# EAGLE design Power Switching Circuit (EAGLE 9.6.2)
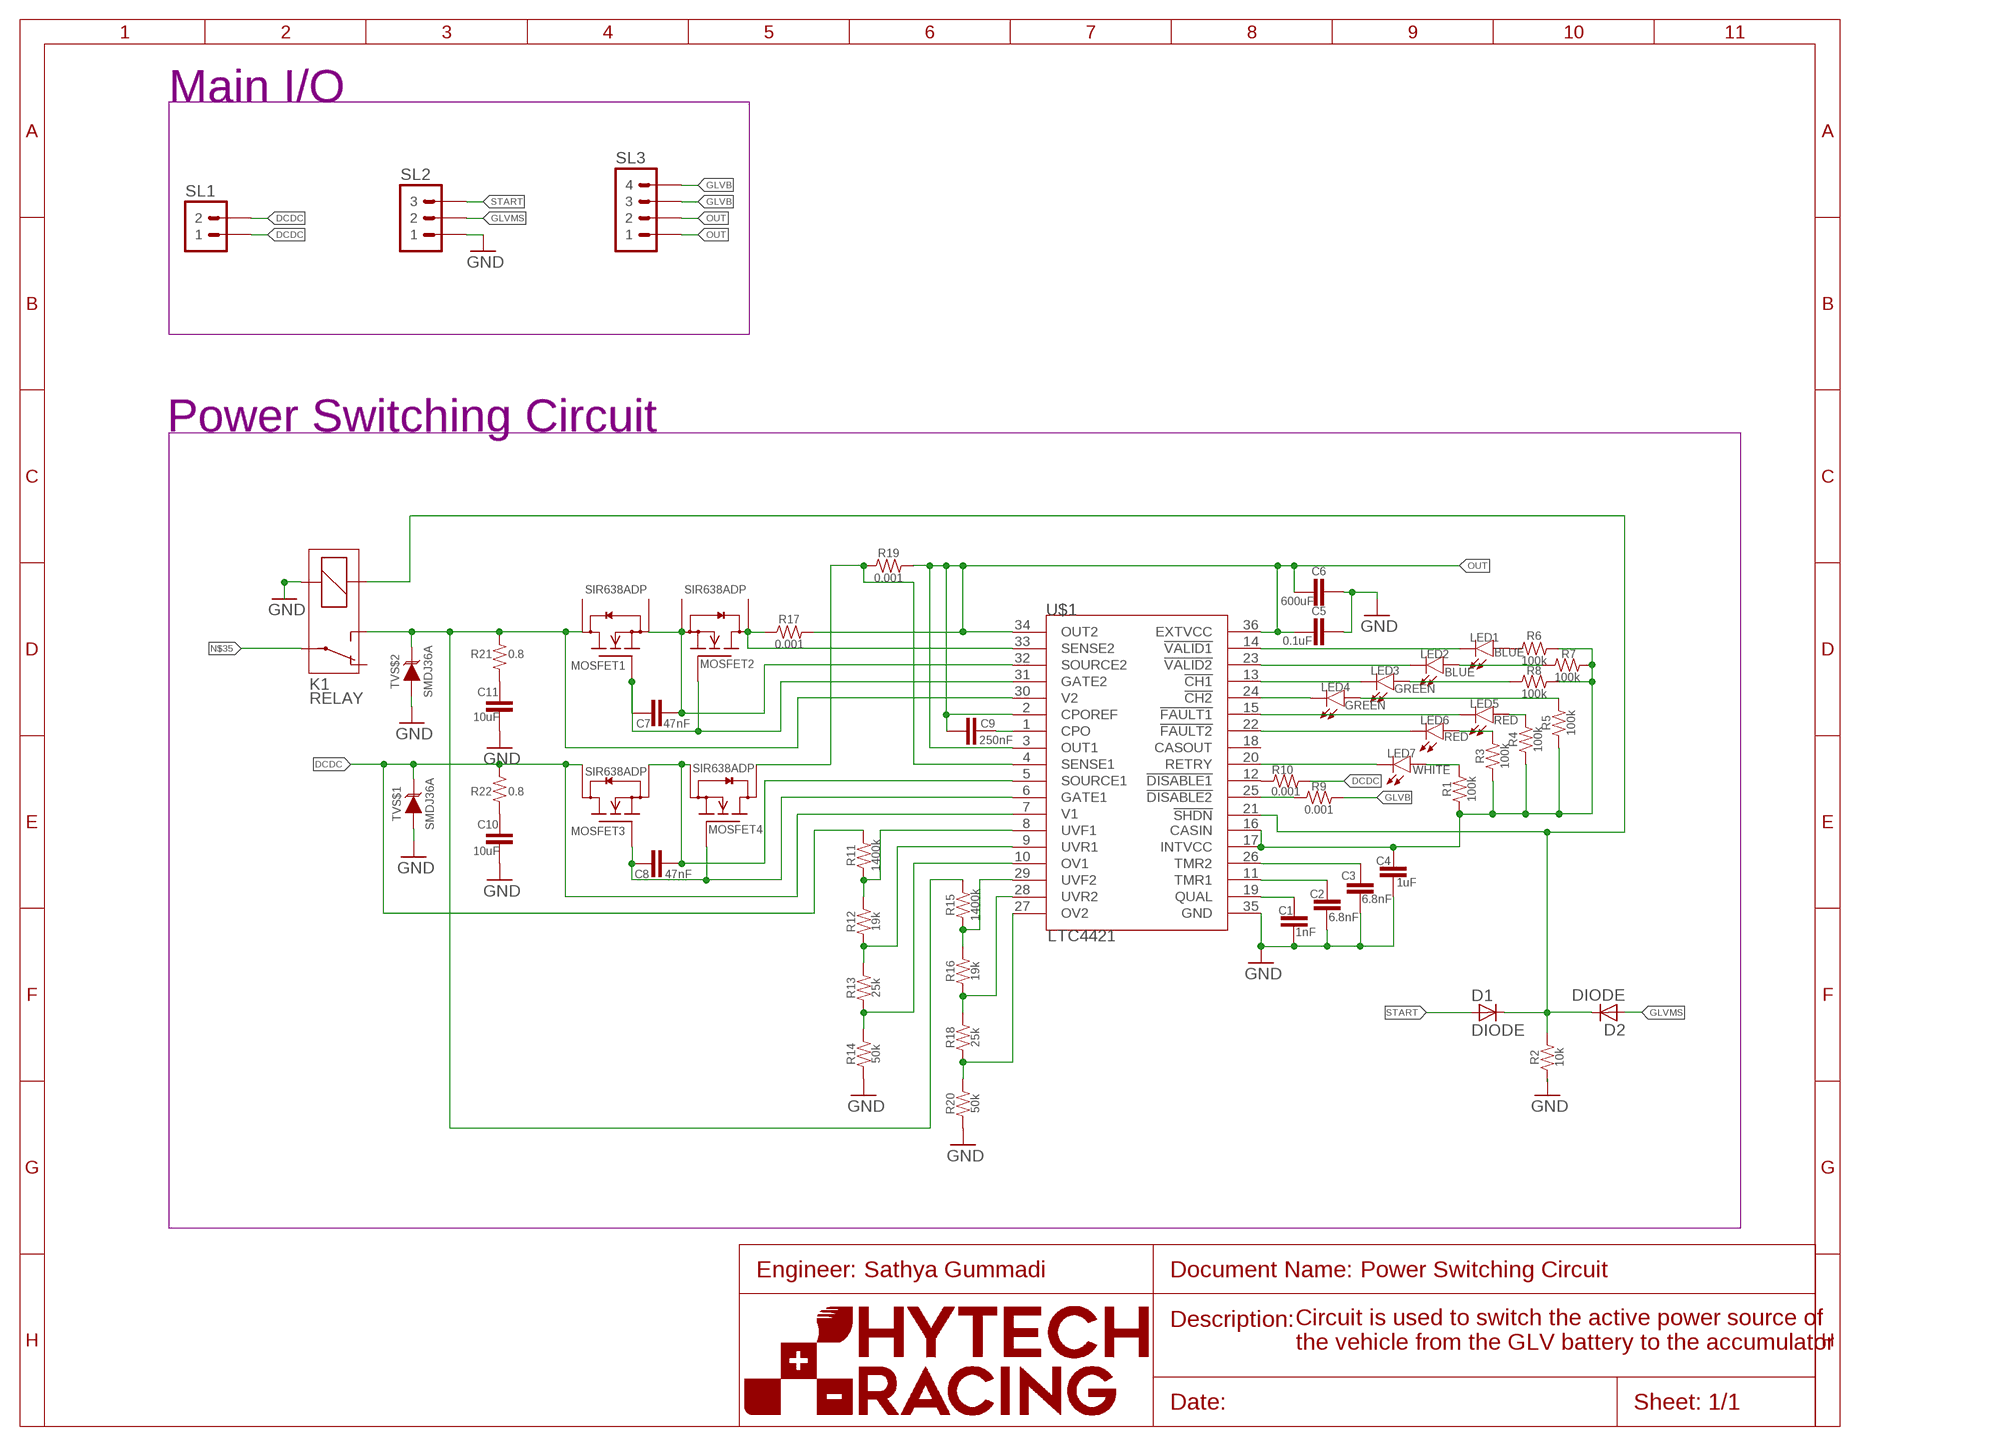
[diagram p0: schematic, sheet 1]
U$2 (FRAME_A): FRAME_DESCRIPTION: Default; ORIENTATION: LANDSCAPE; SIZE: A

## Parts
C1  1nF  CAP0603-CAP  [0603-CAP]
C2  6.8nF  CAP0603-CAP  [0603-CAP]
C3  6.8nF  CAP0603-CAP  [0603-CAP]
C4  1uF  CAP0603-CAP  [0603-CAP]
C5  0.1uF  CAP0603-CAP  [0603-CAP]
C6  600uF  CAP0603-CAP  [0603-CAP]
C7  47nF  CAP0603-CAP  [0603-CAP]
C8  47nF  CAP0603-CAP  [0603-CAP]
C9  250nF  CAP0603-CAP  [0603-CAP]
C10  10uF  CAP0603-CAP  [0603-CAP]
C11  10uF  CAP0603-CAP  [0603-CAP]
D1  DIODE  (no package)
D2  DIODE  (no package)
K1  RELAY  (no package)
LED1  BLUE  LED-0603  [LED-603]
LED2  BLUE  LED-0603  [LED-603]
LED3  GREEN  LED-0603  [LED-603]
LED4  GREEN  LED-0603  [LED-603]
LED5  RED  LED-0603  [LED-603]
LED6  RED  LED-0603  [LED-603]
LED7  WHITE  LED-0603  [LED-603]
MOSFET1  SIR638ADP  [SO-8-POWERPAK]
MOSFET2  SIR638ADP  [SO-8-POWERPAK]
MOSFET3  SIR638ADP  [SO-8-POWERPAK]
MOSFET4  SIR638ADP  [SO-8-POWERPAK]
R1  100k  RESISTOR0603  [0603-RES]
R2  10k  RESISTOR0603  [0603-RES]
R3  100k  RESISTOR0603  [0603-RES]
R4  100k  RESISTOR0603  [0603-RES]
R5  100k  RESISTOR0603  [0603-RES]
R6  100k  RESISTOR0603  [0603-RES]
R7  100k  RESISTOR0603  [0603-RES]
R8  100k  RESISTOR0603  [0603-RES]
R9  0.001  RESISTOR0603  [0603-RES]
R10  0.001  RESISTOR0603  [0603-RES]
R11  1400k  RESISTOR0603  [0603-RES]
R12  19k  RESISTOR0603  [0603-RES]
R13  25k  RESISTOR0603  [0603-RES]
R14  50k  RESISTOR0603  [0603-RES]
R15  1400k  RESISTOR0603  [0603-RES]
R16  19k  RESISTOR0603  [0603-RES]
R17  0.001  RESISTOR0603  [0603-RES]
R18  25k  RESISTOR0603  [0603-RES]
R19  0.001  RESISTOR0603  [0603-RES]
R20  50k  RESISTOR0603  [0603-RES]
R21  0.8  RESISTOR0603  [0603-RES]
R22  0.8  RESISTOR0603  [0603-RES]
SL1  M02  (no package)
SL2  M03  (no package)
SL3  M04  (no package)
TVS$1  SMDJ36A  [SMDJ36A]
TVS$2  SMDJ36A  [SMDJ36A]
U$1  LTC4421  [TSSOP-36]

## Nets
DCDC: MOSFET3.8(D) R10.2 R11.2 R22.2 SL1.1 SL1.2 TVS$1.P$2(C) U$1.7(V1)
GLVB: K1.S MOSFET1.6(D) R9.2 R15.2 R21.2 SL3.3 SL3.4 TVS$2.P$2(C) U$1.30(V2)
GLVMS: D2.A SL2.2
GND: C1.2 C2.2 C3.2 C4.2 C5.1 C6.1 C10.2 C11.2 K1.2 R2.1 R14.1 R20.1 SL2.1 TVS$1.P$1(A) TVS$2.P$1(A) U$1.35(GND)
N$1: R10.1 U$1.12(!DISABLE1)
N$2: C3.1 U$1.26(TMR2)
N$3: C2.1 U$1.11(TMR1)
N$4: C1.1 U$1.19(QUAL)
N$5: LED7.C U$1.20(RETRY)
N$6: LED1.A R6.1
N$7: LED4.C U$1.24(!CH2)
N$8: C7.1 MOSFET1.2(S) MOSFET2.2(S) U$1.32(SOURCE2)
N$9: LED6.C U$1.22(!FAULT2)
N$10: LED5.C U$1.15(!FAULT1)
N$11: LED3.C U$1.13(!CH1)
N$12: LED2.C U$1.23(!VALID2)
N$13: LED1.C U$1.14(!VALID1)
N$14: LED4.A R5.2
N$15: LED3.A R8.1
N$16: LED2.A R7.1
N$17: LED7.A R1.2
N$18: D1.C D2.C K1.1 R2.2 U$1.21(!SHDN)
N$19: LED6.A R3.2
N$20: LED5.A R4.2
N$21: C4.1 R1.1 R3.1 R4.1 R5.1 R6.2 R7.2 R8.2 U$1.16(CASIN) U$1.17(INTVCC)
N$22: R9.1 U$1.25(!DISABLE2)
N$23: R18.1 R20.2 U$1.27(OV2)
N$24: R16.1 R18.2 U$1.28(UVR2)
N$25: R15.1 R16.2 U$1.29(UVF2)
N$26: R11.1 R12.2 U$1.8(UVF1)
N$27: C8.1 MOSFET3.4(S) MOSFET4.4(S) U$1.5(SOURCE1)
N$28: R12.1 R13.2 U$1.9(UVR1)
N$29: R13.1 R14.2 U$1.10(OV1)
N$30: C11.1 R21.1
N$31: MOSFET2.6(D) R17.1 U$1.33(SENSE2)
N$32: C7.2 MOSFET1.1(G) MOSFET2.1(G) U$1.31(GATE2)
N$33: C10.1 R22.1
N$34: C8.2 MOSFET3.1(G) MOSFET4.1(G) U$1.6(GATE1)
N$35: K1.P
N$38: C9.1 U$1.1(CPO)
N$40: MOSFET4.8(D) R19.1 U$1.4(SENSE1)
OUT: C5.2 C6.2 C9.2 R17.2 R19.2 SL3.1 SL3.2 U$1.2(CPOREF) U$1.3(OUT1) U$1.34(OUT2) U$1.36(EXTVCC)
START: D1.A SL2.3
Unconnected: K1.O MOSFET1.3(S) MOSFET1.4(S) MOSFET1.5(D) MOSFET1.7(D) MOSFET1.8(D) MOSFET2.3(S) MOSFET2.4(S) MOSFET2.5(D) MOSFET2.7(D) MOSFET2.8(D) MOSFET3.2(S) MOSFET3.3(S) MOSFET3.5(D) MOSFET3.6(D) MOSFET3.7(D) MOSFET4.2(S) MOSFET4.3(S) MOSFET4.5(D) MOSFET4.6(D) MOSFET4.7(D) U$1.18(CASOUT)

## Notes on the sheet
- Main I/O
- Power Switching Circuit
- Sathya Gummadi
- Circuit is used to switch the active power source of 
  the vehicle from the GLV battery to the accumulator

## Library data of the parts
C1-C11 = HyTechDevices:CAP: Capacitor Standard 0603 ceramic capacitor, and 0.1" leaded capacitor.
D1 D2 = HyTechSymbols:DIODE: Generic Diode
K1 = HyTechSymbols:RELAY: RELAY 1 x switch
LED1-LED7 = HyTechDevices:LED: Light Emitting Diode (LED) Source: Dangerous Prototypes Eagle Library <https://github.com/DangerousPrototypes/Eagle_Part_Library>
MOSFET1-MOSFET4 = HyTechDevices:SIR638ADP: Vishay Siliconix SiR638ADP N-Channel 40 V (D-S) MOSFET Datasheet <https://www.vishay.com/docs/75297/sir638adp.pdf>
R1-R22 = HyTechDevices:RESISTOR: Resistor Basic schematic elements and footprints for 0603, 1206, and PTH resistors.
SL1 = HyTechSymbols:M02: Generic 2-pin connector
SL2 = HyTechSymbols:M03: Generic 3-pin connector
SL3 = HyTechSymbols:M04: Generic 4-pin connector
TVS$1 TVS$2 = HyTechDevices:SMDJ36A: Littlefuse SMDJ36A TVS Diode Datasheet <https://www.littelfuse.com/~/media/electronics/datasheets/tvs_diodes/littelfuse_tvs_diode_smdj_datasheet.pdf.pdf>
U$1 = HyTechDevices:LTC4421: LTC4421 High Power Prioritized PowerPath Controller Datasheet <https://www.analog.com/media/en/technical-documentation/data-sheets/LTC4421.pdf>

## Board
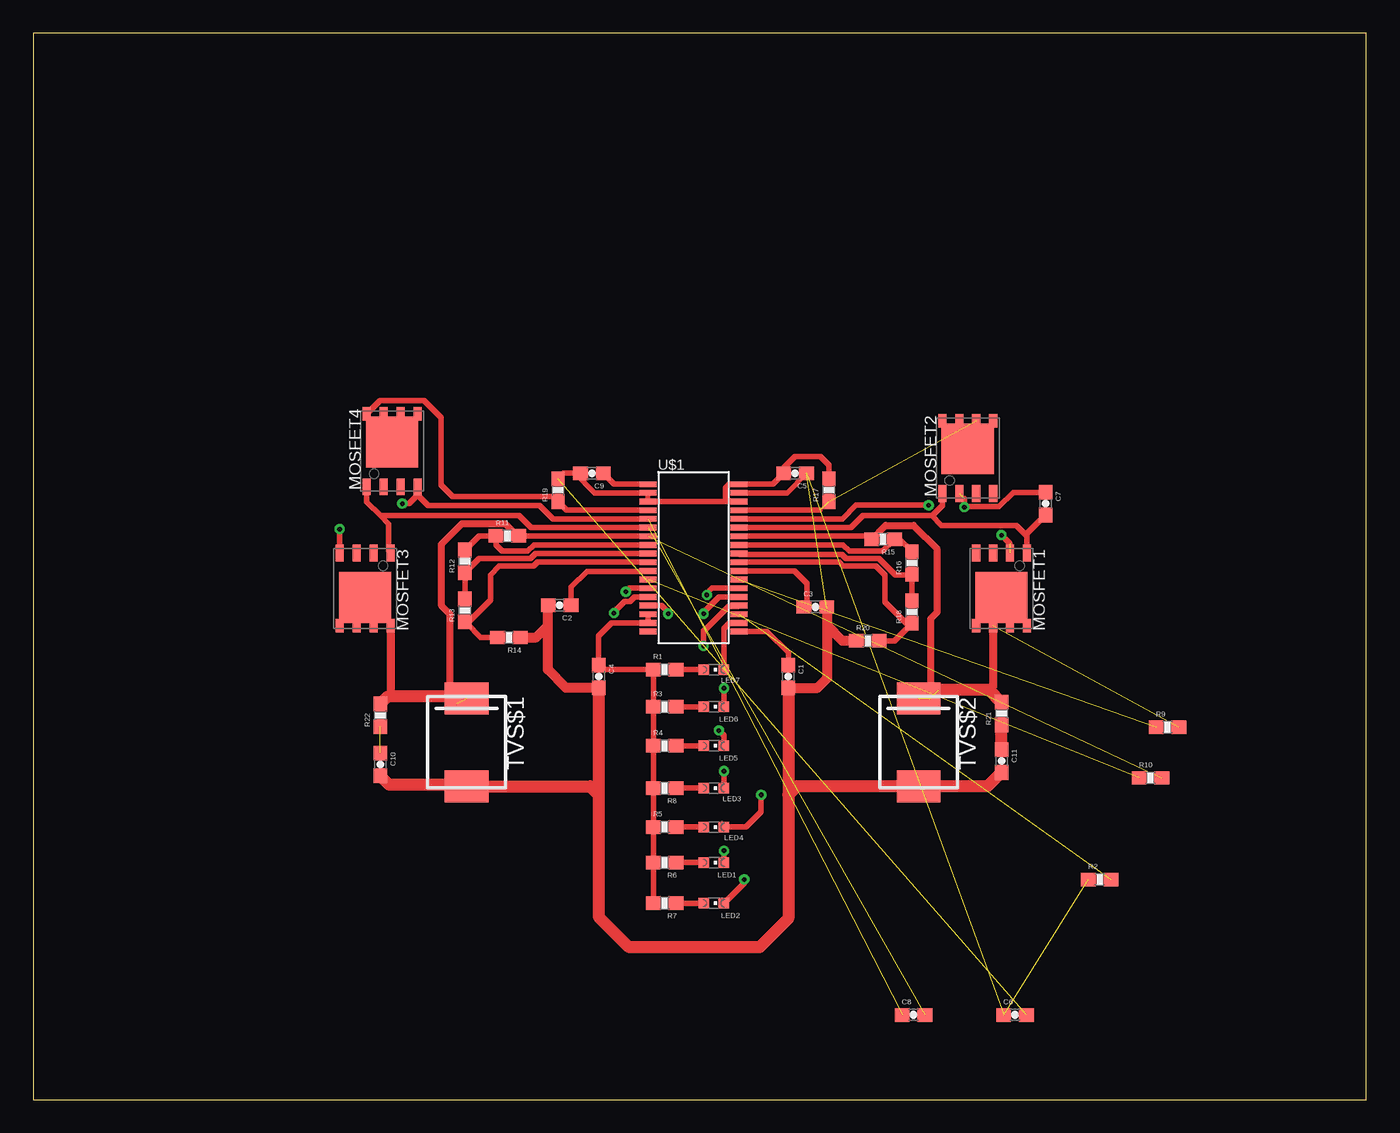
[diagram p1: board, top side]
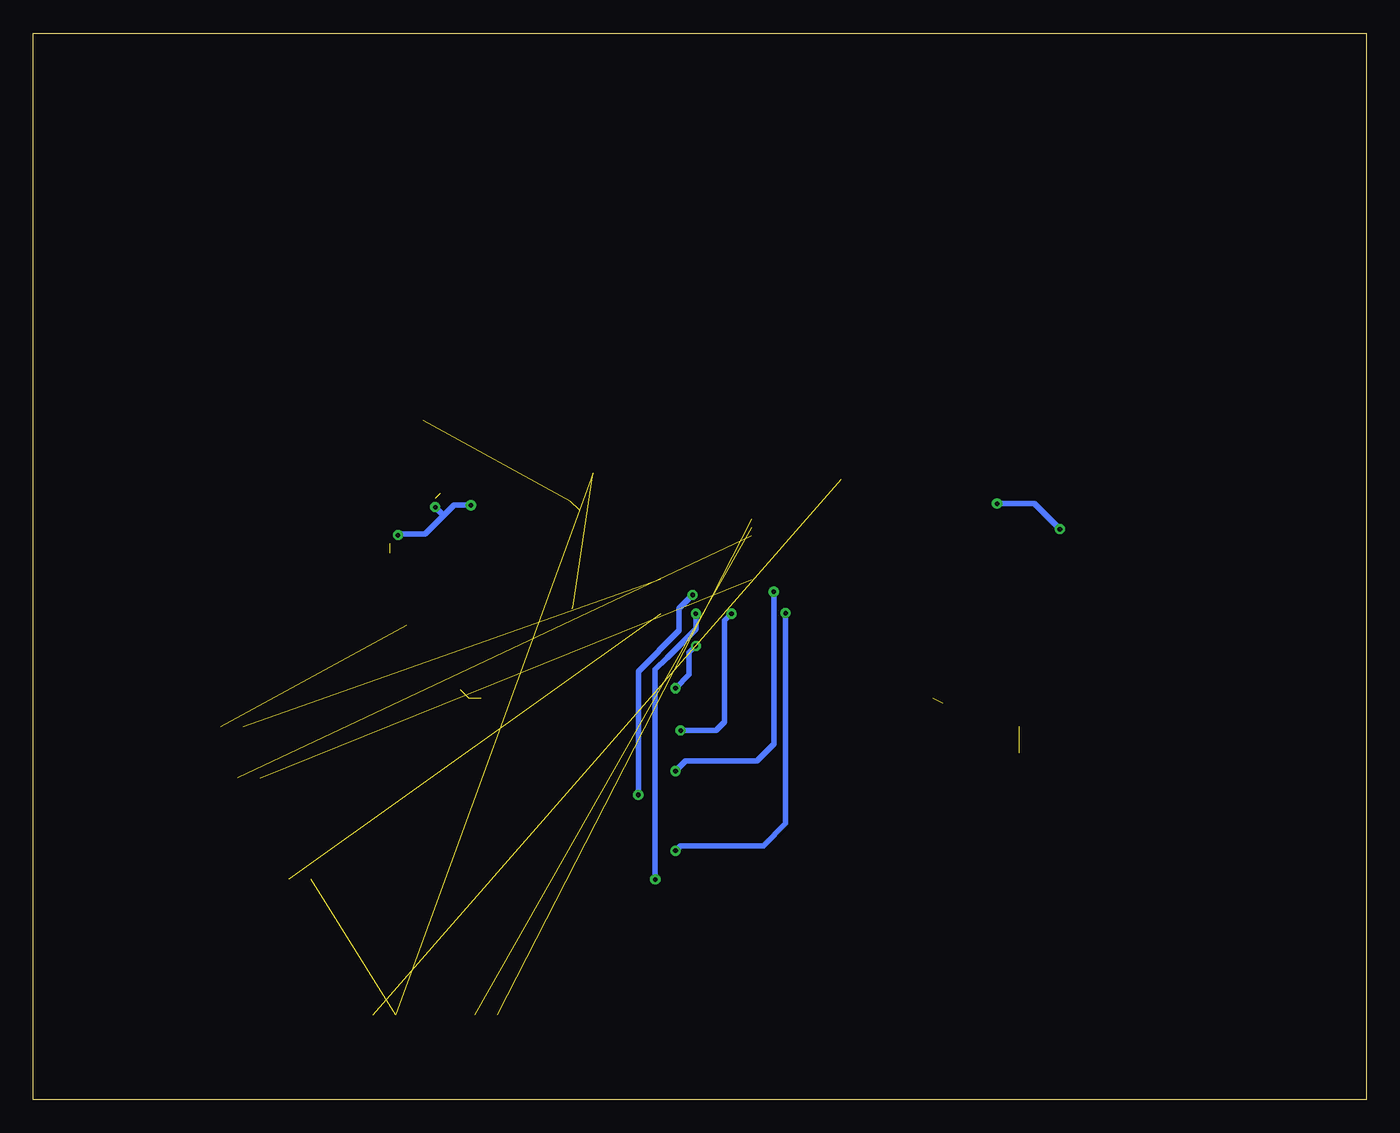
[diagram p2: board, bottom side, seen from below]

Size 100 x 80 mm. Coordinates in mm from the lower left corner, seen from the top.
Outline: 0,0 100,0 100,80 0,80 0,0
Copper layers (1*16): Top 0.035mm / dielectric 1.5mm / Bottom 0.035mm
Design rules "default": minimum track width 6mil, minimum drill 0.35mm, track to track 6mil, track to pad 6mil, pad to pad 6mil, via to via 6mil, smd to smd 6mil, copper to edge 40mil, drill to drill 6mil, minimum pad ring 10mil, minimum via ring 8mil, stop-mask expansion 4mil, vias tented up to drill 0mil, thermal gap 10mil

### Footprints (pad centres in the part's own frame; a part is rotated, then mirrored left to right if it is on the bottom)
0603-CAP = smd 1.1 x 1: 1 -0.85,0; 2 0.85,0
LED-603 = smd 0.8 x 0.8: A 0,-0.75; C 0,0.75
SO-8-POWERPAK = smd 1.27 x 0.61: 1 -3.429,1.905; 2 -3.429,0.635; 3 -3.429,-0.635; 4 -3.429,-1.905 | smd 1.016 x 0.61: 5 2.032,-1.905; 6 2.032,-0.635; 7 2.032,0.635; 8 2.032,1.905 | smd 3.81 x 3.912: P$1 -0.076,0
0603-RES = smd 1.1 x 1: 1 -0.85,0; 2 0.85,0
SMDJ36A = smd 2.388 x 3.277: P$1 3.302,0; P$2 -3.302,0
TSSOP-36 = smd 1.27 x 0.432: 1 -3.404,5.527; 2 -3.404,4.877; 3 -3.404,4.227; 4 -3.404,3.576; 5 -3.404,2.926; 6 -3.404,2.276; 7 -3.404,1.626; 8 -3.404,0.975; 9 -3.404,0.325; 10 -3.404,-0.325; 11 -3.404,-0.975; 12 -3.404,-1.626; 13 -3.404,-2.276; 14 -3.404,-2.926; 15 -3.404,-3.576; 16 -3.404,-4.227; 17 -3.404,-4.877; 18 -3.404,-5.527; 19 3.404,-5.527; 20 3.404,-4.877; 21 3.404,-4.227; 22 3.404,-3.576; 23 3.404,-2.926; 24 3.404,-2.276; 25 3.404,-1.626; 26 3.404,-0.975; 27 3.404,-0.325; 28 3.404,0.325; 29 3.404,0.975; 30 3.404,1.626; 31 3.404,2.276; 32 3.404,2.926; 33 3.404,3.576; 34 3.404,4.227; 35 3.404,4.877; 36 3.404,5.527

### Placement (x,y rotation side)
C1  56.64,31.75 270 top
C2  39.5,37.08 180 top
C3  58.67,36.96 0 top
C4  42.42,31.75 270 top
C5  57.15,46.99 180 top
C6  73.66,6.35 0 top
C7  75.95,44.7 270 top
C8  66.04,6.35 0 top
C9  41.91,46.99 180 top
C10  26.04,25.15 270 top
C11  72.64,25.4 270 top
LED1  51.05,17.78 270 top
LED2  51.05,14.73 270 top
LED3  51.05,23.37 270 top
LED4  51.05,20.45 270 top
LED5  51.05,26.54 270 top
LED6  51.05,29.46 270 top
LED7  51.05,32.26 270 top
MOSFET1  72.64,37.59 270 top
MOSFET2  70.1,48.9 90 top
MOSFET3  24.89,37.59 270 top
MOSFET4  26.92,49.4 90 top
R1  47.37,32.26 0 top
R2  80.01,16.51 0 top
R3  47.37,29.46 0 top
R4  47.37,26.54 0 top
R5  47.37,20.45 0 top
R6  47.37,17.78 180 top
R7  47.37,14.73 180 top
R8  47.37,23.37 180 top
R9  85.09,27.94 0 top
R10  83.82,24.13 0 top
R11  35.56,42.29 0 top
R12  32.38,40.39 90 top
R13  32.38,36.7 90 top
R14  35.69,34.67 180 top
R15  63.75,42.04 180 top
R16  65.91,40.26 90 top
R17  59.69,45.72 90 top
R18  65.91,36.58 90 top
R19  39.37,45.72 90 top
R20  62.61,34.42 0 top
R21  72.64,28.96 90 top
R22  26.04,28.83 90 top
TVS$1  32.51,26.8 270 top
TVS$2  66.42,26.8 270 top
U$1  49.53,40.64 0 top

### Tracks (layer width: path | path; a pad name or v marks a point on that pad's centre or on a via)
DCDC  (2 unrouted)
  Top 0.406: 36.83,42.27 U$1.7 | 32.27,43.2 32.15,43.2 | 31.62,29.59 31.75,29.72
  Top 0.508: 36.83,42.27 36.8,42.29 R11.2 36.34,42.29 35.43,43.2 32.27,43.2 | 33.02,30.61 TVS$1.P$2 | 32.15,43.2 30.61,41.66 30.61,37.08 31.24,36.45 31.24,30.23
  Top 0.61: 26.58,30.23 26.8,30.44 MOSFET3.8
  Top 0.914: TVS$1.P$2 32.38,30.23 31.24,30.23 26.58,30.23 R22.2
GLVB  (3 unrouted)
  Top 0.406: U$1.30 62.67,42.27 R15.2
  Top 0.508: R15.2 63.95,43.08 66.04,43.08 67.82,41.3 67.82,36.58 67.31,36.07 67.31,30.1 | MOSFET1.6 72.01,35.53
  Top 0.61: MOSFET1.6 72.01,31.03 71.72,30.73
  Top 0.914: R21.2 71.72,30.73 67.94,30.73
GND  (4 unrouted)
  Top 0.381: C5.1 56.53,45.52
  Top 0.406: 56.53,45.52 U$1.35 | 38.61,37.05 C2.2 | 56.68,30.86 C1.2
  Top 0.762: 38.61,35.56 38.61,32.26 39.97,30.9 C4.2 | 38.61,35.56 38.61,37.05 | C1.2 58.84,30.9 59.56,31.62 59.56,35.56 | 59.56,35.56 59.56,36.83 | R14.1 37.72,34.67 38.61,35.56 | R20.1 60.71,34.42 59.56,35.56
  Top 0.914: C4.2 42.42,22.86 | 42.42,22.86 42.42,13.72 44.7,11.43 54.48,11.43 56.64,13.59 56.64,22.86 | C1.2 56.64,22.86 | C11.2 71.59,23.5 TVS$2.P$1 57.28,23.5 56.64,22.86 | C10.2 26.71,23.62 32.38,23.62 TVS$1.P$1 41.78,23.5 42.42,22.86
N$1  (1 unrouted)
N$2
  Top 0.406: 57.78,37 C3.1 58.04,37.17 58.04,38.73 57.11,39.66 U$1.26
N$3
  Top 0.406: U$1.11 46.09,39.62 41.53,39.62 40.35,38.44 C2.1
N$4
  Top 0.406: U$1.19 55.06,35.11 56.64,33.53 C1.1
N$5
  Top 0.406: U$1.20 52.23,35.76 51.8,35.34 LED7.C
N$6
  Top 0.406: R6.1 LED1.A
N$7  (via drill 0.35)
  Top 0.406: U$1.24 50.94,38.36 50.53,37.96 v50.53,37.86 | v54.61,22.86 54.61,21.59 53.47,20.45 LED4.C
  Bottom 0.406: v50.53,37.86 51.56,36.83 51.56,35.18 54.61,32.13 v54.61,22.86
N$8  (via drill 0.35)  (2 unrouted)
  Top 0.406: U$1.32 60.69,43.57 61.72,44.59 v67.17,44.59 | v72.64,42.35 73.28,41.71 | 69.85,45.09 v69.85,44.45 69.88,44.48 72.46,44.48 73.54,45.55 C7.1
  Bottom 0.406: v67.17,44.59 68.44,44.59 69.22,43.81 | v72.64,42.35 72.57,42.42 70.61,42.42 69.22,43.81 | v69.85,44.45 69.22,43.81
N$9  (via drill 0.35)
  Top 0.406: U$1.22 52.85,36.98 52.15,36.98 50.34,35.18 50.29,35.18 v50.29,34.04 | v51.82,30.86 51.82,29.48 LED6.C
  Bottom 0.406: v50.29,34.04 50.8,33.53 50.8,31.88 v51.82,30.86
N$10  (via drill 0.35)
  Top 0.406: U$1.15 47.14,37.06 47.62,36.58 v47.62,36.45 | LED5.C 51.8,27.32 v51.44,27.69
  Bottom 0.406: v47.62,36.45 48.13,35.94 48.13,28.32 48.77,27.69 v51.44,27.69
N$11  (via drill 0.35)
  Top 0.406: U$1.13 44.71,38.36 v44.45,38.1 | v51.82,24.64 51.82,23.38 LED3.C
  Bottom 0.406: v44.45,38.1 44.45,26.67 45.72,25.4 51.05,25.4 v51.82,24.64
N$12  (via drill 0.35)
  Top 0.406: U$1.23 51.44,37.71 51.44,37.72 50.23,36.51 v50.29,36.45 | v53.34,16.51 53.34,16.27 LED2.C
  Bottom 0.406: v50.29,36.45 50.29,35.31 52.32,33.27 52.45,33.15 53.34,32.26 v53.34,16.51
N$13  (via drill 0.35)
  Top 0.406: U$1.14 45.1,37.71 44.75,37.37 44.35,37.37 43.56,36.58 v43.56,36.5 | v51.82,18.67 51.82,17.79 LED1.C
  Bottom 0.406: v43.56,36.5 43.56,20.7 45.21,19.05 51.44,19.05 v51.82,18.67
N$14
  Top 0.406: R5.2 LED4.A
N$15
  Top 0.406: R8.1 LED3.A
N$16
  Top 0.406: R7.1 LED2.A
N$17
  Top 0.406: LED7.A R1.2
N$18  (1 unrouted)
N$19
  Top 0.406: R3.2 LED6.A
N$20
  Top 0.406: R4.2 LED5.A
N$21
  Top 0.406: U$1.16 U$1.17 43.38,35.76 42.42,34.8 C4.1 42.76,32.26 R1.1 R3.1 R4.1 R8.2 R5.1 R6.2 R7.2
N$22  (1 unrouted)
N$23
  Top 0.406: U$1.27 60.47,40.31 60.75,40.03 63.22,40.03 63.88,39.37 63.88,37.34 65.49,35.73 R18.1 64.6,34.42 R20.2
N$24
  Top 0.406: R16.1 65.91,39.37 | 65.91,39.37 R18.2 | U$1.28 53.01,40.89 60.69,40.89 60.98,40.59 63.45,40.59 64.67,39.37 65.79,39.37 65.91,39.37
N$25
  Top 0.406: U$1.29 60.75,41.62 61.21,41.15 63.72,41.15 R15.1 65.02,42.04 65.91,41.15 R16.2
N$26
  Top 0.406: R12.2 33.44,42.29 R11.1 34.71,41.62 35.18,41.15 37.08,41.15 37.55,41.62 U$1.8
N$27  (via drill 0.35)  (1 unrouted)
  Top 0.406: U$1.5 38.98,43.57 37.98,44.56 29.6,44.56 28.83,45.34 | v27.69,44.7 28.19,44.7 28.83,45.34 | MOSFET3.4 v22.99,42.8 | MOSFET4.4 28.83,45.34
  Bottom 0.406: v22.99,42.8 24.89,44.7 v27.69,44.7
N$28
  Top 0.406: R13.2 R12.1 33.44,40.59 37.31,40.59 37.69,40.97 U$1.9
N$29
  Top 0.406: R13.1 32.53,35.71 | 32.53,35.71 33.57,34.67 R14.2 | U$1.10 37.83,40.31 37.55,40.03 34.95,40.03 34.29,39.37 34.29,37.47 32.53,35.71
N$30
  Top 0.914: C11.1 R21.1
N$31  (2 unrouted)
  Top 0.406: U$1.33 59.04,44.22
N$32
  Top 0.406: U$1.31 60.31,42.92 | 60.33,42.93 60.31,42.92 | 74.55,42.29 73.76,43.08 68.15,43.08 67.42,43.81 | C7.2 74.55,42.46 74.55,42.29 | 67.42,43.81 62.23,43.81 61.33,42.92 60.31,42.92 | 67.42,43.81 67.45,43.85 67.48,43.85 68.2,44.58 MOSFET2.1 | MOSFET1.1 74.55,42.29
N$33  (1 unrouted)
N$34  (1 unrouted)
  Top 0.406: U$1.6 37.34,42.92 36.45,43.81 26.04,43.81 | 26.04,43.81 25.02,44.83 MOSFET4.1 | MOSFET3.1 26.67,41.15 26.67,43.18 26.04,43.81
N$38
  Top 0.406: U$1.1 43.58,46.17 C9.1
N$40
  Top 0.406: U$1.4 40.02,44.22 R19.1 38.99,45.25 31.46,45.25 30.61,46.1 30.61,51.18 29.34,52.45 26.04,52.45 MOSFET4.8
OUT  (1 unrouted)
  Top 0.381: U$1.3 U$1.2
  Top 0.406: 59.69,46.72 R17.2 59.69,47.62 59.05,48.26 57.15,48.26 56.3,47.41 C5.2 55.48,46.17 U$1.36 52.23,46.17 51.94,45.88 51.94,45.15 52.23,44.87 U$1.34 U$1.3 | R19.2 39.79,46.99 40.64,46.99 | 40.64,46.99 C9.2 | U$1.2 42.11,45.52 40.64,46.99